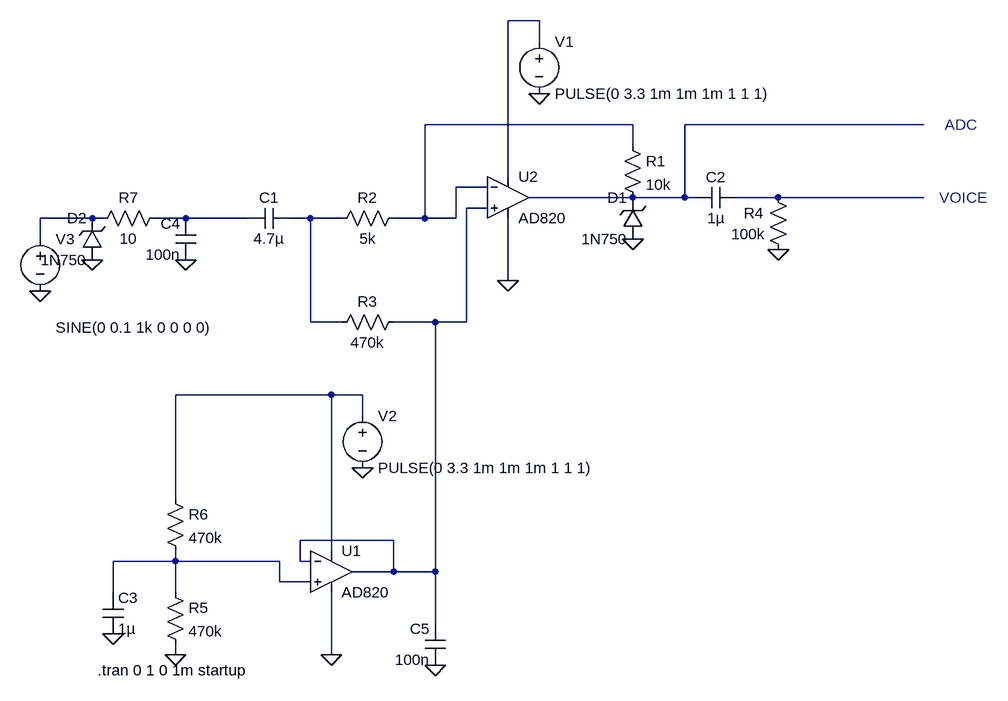
[diagram p0: schematic single_rail_amp_trans.asc]
single_rail_amp_trans.asc, the LTspice schematic file:
Version 4
SHEET 1 900 872
WIRE 208 -144 160 -144
WIRE 208 -112 208 -144
WIRE 352 16 32 16
WIRE 800 16 432 16
WIRE 352 48 352 16
WIRE 160 96 160 -144
WIRE 128 112 80 112
WIRE 352 128 192 128
WIRE 432 128 432 16
WIRE 432 128 352 128
WIRE 448 128 432 128
WIRE 576 128 512 128
WIRE 800 128 576 128
WIRE 128 144 96 144
WIRE -480 160 -560 160
WIRE -464 160 -480 160
WIRE -336 160 -384 160
WIRE -240 160 -336 160
WIRE -144 160 -176 160
WIRE -96 160 -144 160
WIRE 32 160 32 16
WIRE 32 160 -16 160
WIRE 80 160 80 112
WIRE 80 160 32 160
WIRE -560 192 -560 160
WIRE 160 256 160 160
WIRE -144 320 -144 160
WIRE -96 320 -144 320
WIRE 48 320 -16 320
WIRE 96 320 96 144
WIRE 96 320 48 320
WIRE -112 432 -352 432
WIRE -64 432 -112 432
WIRE -64 464 -64 432
WIRE -352 592 -352 432
WIRE -16 656 -160 656
WIRE -112 672 -112 432
WIRE -352 688 -352 672
WIRE -352 688 -448 688
WIRE -192 688 -352 688
WIRE -160 688 -160 656
WIRE -144 688 -160 688
WIRE -16 704 -16 656
WIRE -16 704 -80 704
WIRE 48 704 48 320
WIRE 48 704 -16 704
WIRE -192 720 -192 688
WIRE -144 720 -192 720
WIRE -448 736 -448 688
WIRE -352 736 -352 688
WIRE 48 784 48 704
WIRE -352 832 -352 816
WIRE -112 832 -112 736
FLAG 160 256 0
FLAG 208 -32 0
FLAG -112 832 0
FLAG -64 544 0
FLAG -448 800 0
FLAG -352 832 0
FLAG -560 272 0
FLAG 576 208 0
FLAG -336 224 0
FLAG 48 848 0
FLAG -480 224 0
FLAG 352 192 0
SYMBOL voltage 208 -128 R0
WINDOW 123 0 0 Left 0
WINDOW 39 0 0 Left 0
SYMATTR InstName V1
SYMATTR Value PULSE(0 3.3 1m 1m 1m 1 1 1)
SYMBOL res 336 32 R0
SYMATTR InstName R1
SYMATTR Value 10k
SYMBOL res 0 144 R90
WINDOW 0 0 56 VBottom 2
WINDOW 3 32 56 VTop 2
SYMATTR InstName R2
SYMATTR Value 5k
SYMBOL cap -176 144 R90
WINDOW 0 0 32 VBottom 2
WINDOW 3 32 32 VTop 2
SYMATTR InstName C1
SYMATTR Value 4.7µ
SYMBOL res 0 304 R90
WINDOW 0 0 56 VBottom 2
WINDOW 3 32 56 VTop 2
SYMATTR InstName R3
SYMATTR Value 470k
SYMBOL voltage -64 448 R0
WINDOW 123 0 0 Left 0
WINDOW 39 0 0 Left 0
SYMATTR InstName V2
SYMATTR Value PULSE(0 3.3 1m 1m 1m 1 1 1)
SYMBOL res -368 720 R0
SYMATTR InstName R5
SYMATTR Value 470k
SYMBOL res -368 576 R0
SYMATTR InstName R6
SYMATTR Value 470k
SYMBOL cap -464 736 R0
SYMATTR InstName C3
SYMATTR Value 1µ
SYMBOL voltage -560 176 R0
WINDOW 3 24 152 Left 2
WINDOW 123 24 124 Left 2
WINDOW 39 0 0 Left 0
SYMATTR Value SINE(0 0.1 1k 0 0 0 0)
SYMATTR InstName V3
SYMBOL cap 512 112 R90
WINDOW 0 0 32 VBottom 2
WINDOW 3 32 32 VTop 2
SYMATTR InstName C2
SYMATTR Value 1µ
SYMBOL res 592 224 R180
WINDOW 0 38 72 Left 2
WINDOW 3 36 40 Left 2
SYMATTR InstName R4
SYMATTR Value 100k
SYMBOL res -480 176 R270
WINDOW 0 32 56 VTop 2
WINDOW 3 0 56 VBottom 2
SYMATTR InstName R7
SYMATTR Value 10
SYMBOL cap -320 224 R180
WINDOW 0 24 56 Left 2
WINDOW 3 24 8 Left 2
SYMATTR InstName C4
SYMATTR Value 100n
SYMBOL OpAmps\\AD820 -112 640 R0
SYMATTR InstName U1
SYMBOL OpAmps\\AD820 160 64 R0
SYMATTR InstName U2
SYMBOL cap 64 848 R180
WINDOW 0 24 56 Left 2
WINDOW 3 24 8 Left 2
SYMATTR InstName C5
SYMATTR Value 100n
SYMBOL zener 368 192 R180
WINDOW 0 24 64 Left 2
WINDOW 3 24 0 Left 2
SYMATTR InstName D1
SYMATTR Value 1N750
SYMBOL zener -464 224 R180
WINDOW 0 24 64 Left 2
WINDOW 3 24 0 Left 2
SYMATTR InstName D2
SYMATTR Value 1N750
TEXT -472 856 Left 2 !.tran 0 1 0 1m startup
TEXT 832 16 Left 2 ;ADC
TEXT 824 128 Left 2 ;VOICE

The netlist it stands for:
* single_rail_amp_trans.asc
V1 N001 0 PULSE(0 3.3 1m 1m 1m 1 1 1)
R1 N002 N003 10k
R2 N002 N008 5k
C1 N008 N007 4.7µ
R3 N005 N008 470k
V2 N009 0 PULSE(0 3.3 1m 1m 1m 1 1 1)
R5 N010 0 470k
R6 N009 N010 470k
C3 N010 0 1µ
V3 N006 0 SINE(0 0.1 1k 0 0 0 0)
C2 N004 N003 1µ
R4 0 N004 100k
R7 N006 N007 10
C4 0 N007 100n
XU1 N010 N005 N009 0 N005 AD820  ; pins In+ In- V+ V- OUT
XU2 N005 N002 N001 0 N003 AD820  ; pins In+ In- V+ V- OUT
C5 0 N005 100n
D1 0 N003 1N750
D2 0 N006 1N750
.model D D
.lib standard.dio
.tran 0 1 0 1m startup
* ADC
* VOICE
.backanno
.end